# EAGLE design penghitopoco (EAGLE 7.6.0)
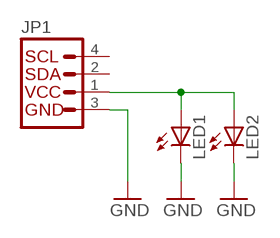
[diagram p0: schematic, sheet 1]

## Parts
JP1  I2C_STANDARDI2C_SAO  [2X2]
LED1  LED5MM  [LED5MM]
LED2  LED5MM  [LED5MM]

## Nets
GND: JP1.3(GND) LED1.K(C) LED2.K(C)
N$1: JP1.1(VCC) LED1.A LED2.A
Unconnected: JP1.2(SDA) JP1.4(SCL)

## Library data of the parts
JP1 = SparkFun-Connectors:I2C_STANDARD: SparkFun has standardized on a pinout for all I2C based sensor breakouts. This pinout allows I2C boards to be plugged directly into the headers on Arduino Uno compatible boards, and to be daisy chained easily.
LED1 LED2 = led:LED: LED OSRAM: - CHIPLED LG R971, LG N971, LY N971, LG Q971, LY Q971, LO R971, LY R971 LH N974, LH R974 LS Q976, LO Q976, LY Q976 LO Q996 - Hyper CHIPLED LW Q18S LB Q993, LB Q99A, LB R99A - SideLED LS A670, LO A670, LY A670, LG A670, LP A670 LB A673, LV A673, LT A673, LW A673 LH A674 LY A675 LS A676, LA A676, LO A676, LY A676, LW A676 LS A679, LY A679, LG A679 - Hyper Micro SIDELED® LS Y876, LA Y876, LO Y876, LY Y876 LT Y87S - SmartLED LW L88C, LW L88S LB L89C, LB L89S, LG L890 LS L89K, LO L89K, LY L89K LS L896, LA L896, LO L896, LY L896 - TOPLED LS T670, LO T670, LY T670, LG T670, LP T670 LSG T670, LSP T670, LSY T670, LOP T670, LYG T670 LG T671, LOG T671, LSG T671 LB T673, LV T673, LT T673, LW T673 LH T674 LS T676, LA T676, LO T676, LY T676, LB T676, LH T676, LSB T676, LW T676 LB T67C, LV T67C, LT T67C, LS T67K, LO T67K, LY T67K, LW E67C LS E67B, LA E67B, LO E67B, LY E67B, LB E67C, LV E67C, LT E67C LW T67C LS T679, LY T679, LG T679 LS T770, LO T770, LY T770, LG T770, LP T770 LB T773, LV T773, LT T773, LW T773 LH T774 LS E675, LA E675, LY E675, LS T675 LS T776, LA T776, LO T776, LY T776, LB T776 LHGB T686 LT T68C, LB T68C - Hyper Mini TOPLED® LB M676 - Mini TOPLED Santana® LG M470 LS M47K, LO M47K, LY M47K Source: http://www.osram.convergy.de LUXEON: - LUMILED® LXK2-PW12-R00, LXK2-PW12-S00, LXK2-PW14-U00, LXK2-PW14-V00 LXK2-PM12-R00, LXK2-PM12-S00, LXK2-PM14-U00 LXK2-PE12-Q00, LXK2-PE12-R00, LXK2-PE12-S00, LXK2-PE14-T00, LXK2-PE14-U00 LXK2-PB12-K00, LXK2-PB12-L00, LXK2-PB12-M00, LXK2-PB14-N00, LXK2-PB14-P00, LXK2-PB14-Q00 LXK2-PR12-L00, LXK2-PR12-M00, LXK2-PR14-Q00, LXK2-PR14-R00 LXK2-PD12-Q00, LXK2-PD12-R00, LXK2-PD12-S00 LXK2-PH12-R00, LXK2-PH12-S00 LXK2-PL12-P00, LXK2-PL12-Q00, LXK2-PL12-R00 Source: www.luxeon.com KINGBRIGHT: KA-3528ASYC Source: www.kingbright.com

## Board
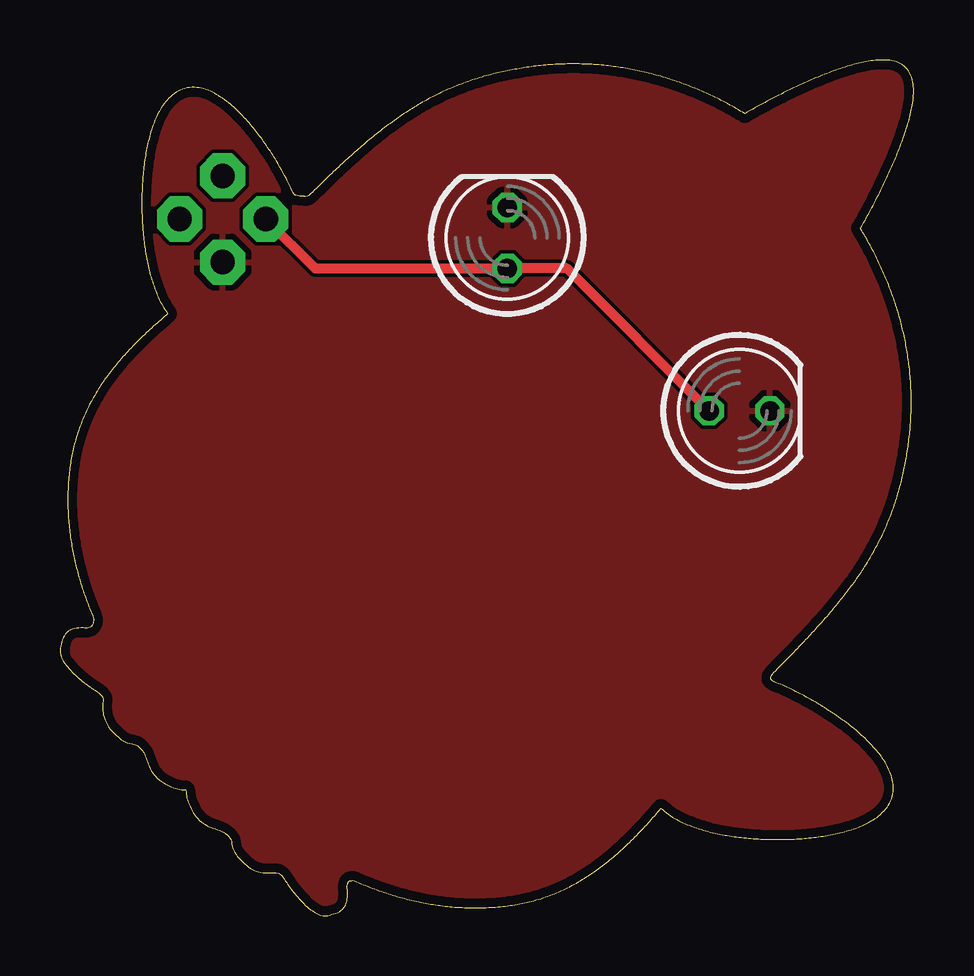
[diagram p1: board, top side]
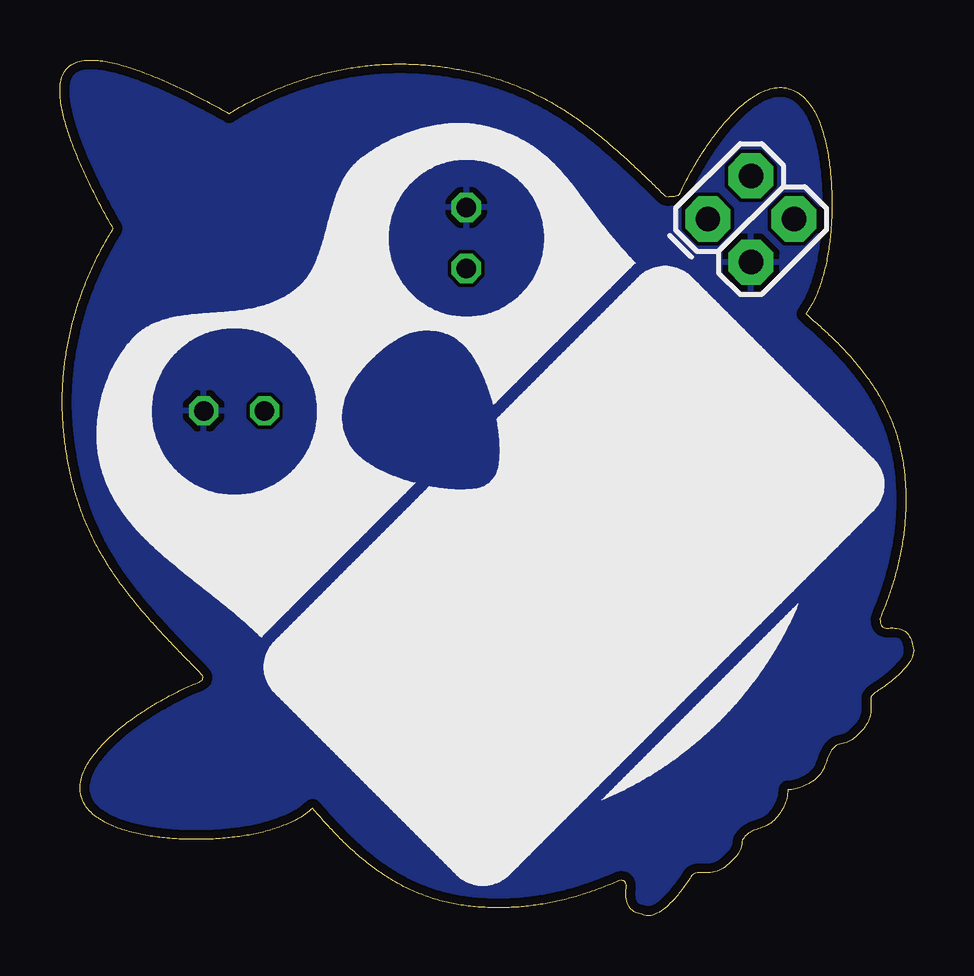
[diagram p2: board, bottom side, seen from below]

Size 35.59 x 35.66 mm. Coordinates in mm from the lower left corner, seen from the top.
Outline: 34.3,35.66 34.2,35.65 34.1,35.65 34,35.64 33.9,35.63 33.8,35.62 33.7,35.6 33.6,35.58 33.51,35.56 33.41,35.54 33.31,35.52 33.21,35.5 33.11,35.47 33.02,35.44 32.92,35.42 32.83,35.39 32.73,35.36 32.64,35.33 32.54,35.3 32.45,35.27 32.35,35.23 32.26,35.2 32.16,35.16 32.07,35.13 31.98,35.09 31.88,35.06 31.79,35.02 31.7,34.98 31.61,34.95 31.51,34.91 31.42,34.87 31.33,34.83 31.24,34.79 31.15,34.75 31.06,34.71 30.96,34.67 30.87,34.63 30.78,34.59 30.69,34.54 30.6,34.5 30.51,34.46 30.42,34.41 30.33,34.37 30.24,34.33 30.15,34.28 30.06,34.24 29.97,34.19 29.88,34.15 29.8,34.1 29.72,34.06 29.63,34.02 29.55,33.97 29.46,33.93 29.38,33.88 29.29,33.84 29.21,33.79 29.13,33.75 29.04,33.7 28.96,33.66 28.88,33.61 28.79,33.56 28.71,33.52 28.63,33.47 28.55,33.42 28.46,33.48 28.37,33.53 28.29,33.58 28.2,33.63 28.11,33.68 28.02,33.73 27.93,33.78 27.85,33.83 27.76,33.87 27.67,33.92 27.58,33.97 27.49,34.01 27.4,34.06 27.31,34.1 27.21,34.14 27.12,34.19 27.03,34.23 26.94,34.27 26.85,34.31 26.76,34.35 26.66,34.39 26.57,34.43 26.48,34.47 26.38,34.51 26.29,34.55 26.19,34.58 26.1,34.62 26.01,34.65 25.91,34.69 25.82,34.72 25.72,34.76 25.62,34.79 25.53,34.82 25.43,34.85 25.34,34.88 25.24,34.91 25.14,34.94 25.05,34.97 24.95,35 24.85,35.02 24.75,35.05 24.66,35.08 24.56,35.1 24.46,35.13 24.36,35.15 24.26,35.17 24.17,35.19 24.07,35.21 23.97,35.23 23.87,35.25 23.77,35.27 23.67,35.29 23.57,35.31 23.47,35.33 23.37,35.34 23.27,35.36 23.17,35.37 23.07,35.38 22.97,35.4 22.87,35.41 22.77,35.42 22.67,35.43 22.57,35.44 22.47,35.45 22.37,35.46 22.27,35.46 22.17,35.47 22.07,35.48 21.97,35.48 21.86,35.49 21.76,35.49 21.66,35.49 21.56,35.49 21.46,35.49 21.36,35.49 21.26,35.49 21.16,35.49 21.06,35.49 20.96,35.49 20.85,35.48 20.75,35.48 20.65,35.47 20.55,35.47 20.45,35.46 20.35,35.45 20.25,35.44 20.15,35.43 20.05,35.42 19.95,35.41 19.85,35.4 19.75,35.39 19.65,35.37 19.55,35.36 19.45,35.35 19.35,35.33 19.25,35.31 19.15,35.3 19.05,35.28 18.96,35.26 18.86,35.25 18.76,35.23 18.66,35.21 18.56,35.19 18.46,35.17 18.37,35.14 18.27,35.12 18.17,35.1 18.07,35.07 17.98,35.05 17.88,35.02 17.78,35 17.69,34.97 17.59,34.94 17.49,34.91 17.4,34.89 17.3,34.85 17.21,34.82 17.11,34.79 17.02,34.76 16.92,34.73 16.83,34.69 16.73,34.66 16.64,34.62 16.55,34.58 16.45,34.55 16.36,34.51 16.27,34.47 16.18,34.43 16.08,34.39 15.99,34.35 15.9,34.3 15.81,34.26 15.72,34.22 15.63,34.17 15.54,34.13 15.45,34.08 15.36,34.03 15.28,33.98 15.19,33.94 15.1,33.89 15.01,33.84 14.93,33.79 14.84,33.73 14.75,33.68 14.67,33.63 14.58,33.58 14.5,33.52 14.42,33.47 14.33,33.41 14.25,33.36 14.17,33.3 14.08,33.24 14,33.19 13.92,33.13 13.84,33.07 13.76,33.01 13.68,32.95 13.6,32.89 13.52,32.83 13.44,32.77 13.36,32.71 13.28,32.64 13.2,32.58 13.12,32.52 13.04,32.46 12.97,32.39 12.89,32.33 12.81,32.26 12.73,32.2 12.66,32.13 12.58,32.07 12.51,32 12.43,31.94 12.35,31.87 12.28,31.81 12.2,31.74 12.13,31.67 12.05,31.6 11.98,31.54 11.91,31.47 11.83,31.4 11.76,31.33 11.69,31.27 11.61,31.2 11.54,31.13 11.47,31.06 11.39,30.99 11.32,30.92 11.25,30.85 11.17,30.78 11.1,30.71 11.03,30.64 10.96,30.57 10.89,30.5 10.81,30.43 10.74,30.36 10.67,30.29 10.6,30.22 10.53,30.15 10.46,30.08 10.41,30.04 10.39,30.02 10.37,30 10.32,29.98 10.23,29.96 10.19,29.98 9.98,29.99 9.92,30 9.91,30.01 9.84,30.01 9.8,30.02 9.76,30.06 9.72,30.13 9.68,30.22 9.64,30.31 9.6,30.39 9.55,30.48 9.51,30.57 9.46,30.66 9.42,30.74 9.37,30.83 9.33,30.92 9.28,31 9.23,31.09 9.18,31.17 9.13,31.26 9.08,31.34 9.03,31.43 8.98,31.51 8.93,31.6 8.88,31.68 8.83,31.76 8.77,31.84 8.72,31.93 8.66,32.01 8.61,32.09 8.55,32.17 8.5,32.25 8.44,32.33 8.38,32.41 8.32,32.49 8.26,32.57 8.2,32.65 8.14,32.73 8.08,32.8 8.02,32.88 7.95,32.96 7.89,33.04 7.82,33.11 7.75,33.19 7.69,33.26 7.62,33.33 7.55,33.41 7.48,33.48 7.41,33.55 7.33,33.62 7.26,33.68 7.18,33.75 7.11,33.81 7.03,33.88 6.95,33.94 6.87,34 6.79,34.06 6.71,34.11 6.62,34.17 6.54,34.22 6.45,34.27 6.36,34.31 6.27,34.35 6.18,34.39 6.09,34.42 5.99,34.45 5.9,34.48 5.8,34.49 5.7,34.51 5.6,34.51 5.5,34.51 5.4,34.51 5.3,34.49 5.21,34.47 5.11,34.44 5.02,34.4 4.93,34.36 4.84,34.31 4.76,34.26 4.68,34.2 4.6,34.13 4.53,34.06 4.47,33.99 4.4,33.91 4.34,33.83 4.28,33.75 4.23,33.67 4.18,33.59 4.13,33.5 4.08,33.41 4.04,33.32 4,33.23 3.96,33.14 3.92,33.05 3.88,32.95 3.85,32.86 3.82,32.76 3.79,32.67 3.76,32.57 3.73,32.47 3.71,32.38 3.68,32.28 3.66,32.18 3.64,32.08 3.62,31.99 3.6,31.89 3.58,31.79 3.57,31.69 3.55,31.59 3.53,31.49 3.52,31.39 3.51,31.29 3.49,31.19 3.48,31.09 3.47,30.99 3.46,30.89 3.45,30.79 3.45,30.69 3.44,30.59 3.43,30.49 3.43,30.39 3.42,30.29 3.42,30.19 3.41,30.09 3.41,29.99 3.41,29.89 3.41,29.79 3.41,29.68 3.41,29.58 3.41,29.48 3.41,29.38 3.41,29.28 3.42,29.18 3.42,29.08 3.43,28.98 3.43,28.88 3.44,28.78 3.44,28.68 3.45,28.58 3.46,28.48 3.47,28.38 3.48,28.28 3.49,28.18 3.5,28.08 3.52,27.98 3.53,27.88 3.54,27.78 3.56,27.68 3.57,27.58 3.59,27.48 3.61,27.38 3.63,27.28 3.65,27.18 3.67,27.08 3.69,26.99 3.72,26.89 3.74,26.79 3.77,26.7 3.8,26.6 3.82,26.51 3.85,26.41 3.89,26.32 3.92,26.22 3.95,26.13 3.99,26.04 4.02,25.94 4.06,25.85 4.1,25.76 4.14,25.67 4.19,25.58 4.23,25.5 4.28,25.41 4.33,25.32 4.38,25.24 4.44,25.16 4.5,25.08 4.42,25.01 4.34,24.95 4.27,24.88 4.19,24.82 4.12,24.75 4.04,24.69 3.97,24.62 3.89,24.55 3.82,24.49 3.75,24.42 3.67,24.35 3.6,24.28 3.53,24.21 3.45,24.15 3.38,24.08 3.31,24.01 3.24,23.94 3.17,23.87 3.1,23.79 3.03,23.72 2.96,23.65 2.89,23.58 2.82,23.51 2.75,23.43 2.69,23.36 2.62,23.28 2.56,23.21 2.49,23.13 2.43,23.06 2.36,22.98 2.3,22.9 2.24,22.82 2.17,22.75 2.11,22.67 2.05,22.59 1.99,22.51 1.93,22.43 1.87,22.35 1.82,22.26 1.76,22.18 1.71,22.1 1.65,22.01 1.6,21.93 1.54,21.85 1.49,21.76 1.44,21.67 1.39,21.59 1.34,21.5 1.29,21.41 1.25,21.32 1.2,21.24 1.16,21.15 1.11,21.06 1.07,20.97 1.03,20.88 0.99,20.78 0.95,20.69 0.91,20.6 0.88,20.51 0.84,20.41 0.81,20.32 0.77,20.22 0.74,20.13 0.71,20.04 0.68,19.94 0.65,19.84 0.63,19.75 0.6,19.65 0.57,19.55 0.55,19.46 0.53,19.36 0.51,19.26 0.49,19.16 0.47,19.07 0.45,18.97 0.44,18.87 0.42,18.77 0.41,18.67 0.4,18.57 0.39,18.47 0.38,18.37 0.37,18.27 0.36,18.17 0.35,18.07 0.35,17.97 0.34,17.87 0.34,17.77 0.33,17.67 0.33,17.57 0.33,17.47 0.33,17.37 0.33,17.27 0.33,17.17 0.33,17.07 0.33,16.97 0.34,16.87 0.34,16.77 0.35,16.67 0.35,16.57 0.36,16.47 0.37,16.37 0.38,16.27 0.39,16.17 0.4,16.07 0.41,15.97 0.42,15.88 0.43,15.78 0.45,15.68 0.46,15.58 0.48,15.48 0.5,15.38 0.51,15.28 0.53,15.18 0.55,15.09 0.57,14.99 0.59,14.89 0.61,14.79 0.64,14.69 0.66,14.6 0.68,14.5 0.71,14.4 0.73,14.31 0.76,14.21 0.79,14.11 0.82,14.02 0.84,13.92 0.87,13.82 0.9,13.73 0.93,13.63 0.97,13.54 1,13.44 1.03,13.35 1.06,13.26 1.1,13.16 1.13,13.07 1.17,12.97 1.21,12.88 1.24,12.79 1.28,12.69 1.32,12.6 1.36,12.51 1.4,12.42 1.41,12.35 1.4,12.28 1.39,12.24 1.38,12.18 1.35,12.11 1.31,12.04 1.27,12.01 1.21,11.99 1.14,11.97 1.13,11.98 1.04,11.99 0.97,11.99 0.88,11.99 0.79,11.99 0.69,11.98 0.6,11.96 0.51,11.94 0.43,11.9 0.35,11.85 0.28,11.79 0.22,11.72 0.17,11.65 0.13,11.57 0.1,11.49 0.08,11.41 0.05,11.32 0.03,11.24 0.01,11.15 0,11.05 0.01,10.96 0.03,10.87 0.06,10.78 0.1,10.69 0.15,10.61 0.2,10.53 0.26,10.45 0.32,10.37 0.38,10.29 0.45,10.22 0.51,10.15 0.58,10.09 0.65,10.02 0.72,9.96 0.79,9.9 0.86,9.84 0.93,9.78 1.01,9.72 1.08,9.66 1.16,9.6 1.23,9.55 1.31,9.49 1.39,9.44 1.47,9.39 1.55,9.34 1.62,9.29 1.68,9.24 1.74,9.18 1.78,9.1 1.8,9.02 1.8,8.93 1.79,8.85 1.78,8.75 1.78,8.66 1.79,8.56 1.8,8.47 1.81,8.37 1.83,8.28 1.86,8.19 1.9,8.1 1.94,8.02 1.99,7.93 2.04,7.85 2.1,7.78 2.16,7.71 2.22,7.64 2.28,7.57 2.35,7.51 2.42,7.45 2.49,7.39 2.56,7.34 2.64,7.29 2.72,7.24 2.81,7.21 2.91,7.18 3,7.16 3.08,7.15 3.16,7.13 3.24,7.09 3.31,7.03 3.37,6.96 3.43,6.89 3.48,6.82 3.52,6.74 3.56,6.65 3.59,6.57 3.62,6.48 3.65,6.39 3.68,6.31 3.71,6.22 3.75,6.13 3.8,6.04 3.86,5.96 3.92,5.88 3.98,5.81 4.05,5.74 4.13,5.67 4.21,5.61 4.29,5.56 4.38,5.51 4.46,5.46 4.55,5.42 4.64,5.38 4.74,5.34 4.82,5.31 4.9,5.29 4.99,5.27 5.07,5.26 5.16,5.25 5.25,5.25 5.25,5.16 5.26,5.08 5.27,4.99 5.29,4.9 5.31,4.82 5.34,4.74 5.38,4.65 5.42,4.55 5.46,4.46 5.51,4.38 5.56,4.29 5.61,4.21 5.67,4.13 5.74,4.05 5.81,3.98 5.88,3.92 5.96,3.86 6.04,3.8 6.13,3.75 6.22,3.71 6.31,3.68 6.39,3.65 6.48,3.62 6.57,3.59 6.65,3.56 6.74,3.52 6.82,3.48 6.89,3.43 6.96,3.37 7.03,3.31 7.09,3.24 7.13,3.16 7.15,3.08 7.16,3 7.18,2.91 7.21,2.81 7.24,2.72 7.29,2.64 7.34,2.56 7.39,2.49 7.45,2.42 7.51,2.35 7.57,2.28 7.64,2.22 7.71,2.16 7.78,2.1 7.85,2.04 7.93,1.99 8.02,1.94 8.1,1.9 8.19,1.86 8.28,1.83 8.37,1.81 8.47,1.8 8.56,1.79 8.66,1.78 8.75,1.78 8.85,1.79 8.93,1.8 9.02,1.8 9.1,1.78 9.18,1.74 9.24,1.68 9.29,1.62 9.34,1.55 9.39,1.47 9.44,1.39 9.49,1.31 9.55,1.23 9.6,1.16 9.66,1.08 9.72,1.01 9.78,0.93 9.84,0.86 9.9,0.79 9.96,0.72 10.02,0.65 10.09,0.58 10.15,0.51 10.22,0.45 10.29,0.38 10.37,0.32 10.45,0.26 10.53,0.2 10.61,0.15 10.69,0.1 10.78,0.06 10.87,0.03 10.96,0.01 11.05,0 11.15,0.01 11.24,0.03 11.32,0.05 11.41,0.08 11.49,0.1 11.57,0.13 11.65,0.17 11.72,0.22 11.79,0.28 11.85,0.35 11.9,0.43 11.94,0.52 11.96,0.6 11.98,0.69 11.99,0.79 11.99,0.88 11.99,0.97 11.99,1.06 11.98,1.16 11.97,1.25 11.98,1.29 11.99,1.34 12.01,1.35 12.02,1.4 12.08,1.45 12.15,1.46 12.19,1.47 12.28,1.46 12.37,1.42 12.47,1.38 12.56,1.34 12.65,1.3 12.75,1.26 12.84,1.22 12.93,1.19 13.03,1.15 13.12,1.12 13.22,1.08 13.31,1.05 13.41,1.01 13.5,0.98 13.6,0.95 13.69,0.92 13.79,0.89 13.89,0.86 13.98,0.83 14.08,0.8 14.18,0.77 14.27,0.75 14.37,0.72 14.47,0.7 14.57,0.67 14.66,0.65 14.76,0.62 14.86,0.6 14.96,0.58 15.06,0.56 15.16,0.54 15.26,0.52 15.35,0.5 15.45,0.49 15.55,0.47 15.65,0.46 15.75,0.44 15.85,0.43 15.95,0.42 16.05,0.4 16.15,0.39 16.25,0.38 16.35,0.37 16.45,0.36 16.55,0.36 16.66,0.35 16.76,0.34 16.86,0.34 16.96,0.34 17.06,0.33 17.16,0.33 17.26,0.33 17.36,0.33 17.46,0.33 17.56,0.33 17.66,0.34 17.76,0.34 17.86,0.34 17.97,0.35 18.07,0.36 18.17,0.36 18.27,0.37 18.37,0.38 18.47,0.39 18.57,0.4 18.67,0.42 18.77,0.43 18.87,0.44 18.97,0.46 19.07,0.48 19.17,0.5 19.26,0.51 19.36,0.54 19.46,0.56 19.56,0.58 19.66,0.61 19.75,0.63 19.85,0.66 19.95,0.69 20.04,0.72 20.14,0.75 20.24,0.78 20.33,0.82 20.43,0.85 20.52,0.89 20.61,0.92 20.71,0.96 20.8,1 20.89,1.04 20.98,1.09 21.08,1.13 21.17,1.17 21.26,1.22 21.35,1.26 21.43,1.31 21.52,1.36 21.61,1.41 21.7,1.46 21.78,1.51 21.87,1.57 21.96,1.62 22.04,1.67 22.12,1.73 22.21,1.79 22.29,1.84 22.37,1.9 22.46,1.96 22.54,2.02 22.62,2.08 22.7,2.14 22.78,2.21 22.86,2.27 22.93,2.33 23.01,2.4 23.09,2.46 23.17,2.53 23.24,2.59 23.32,2.66 23.39,2.73 23.47,2.79 23.54,2.86 23.61,2.93 23.69,3 23.76,3.07 23.83,3.14 23.9,3.21 23.97,3.29 24.04,3.36 24.11,3.43 24.18,3.5 24.25,3.58 24.32,3.65 24.39,3.72 24.46,3.8 24.53,3.87 24.59,3.95 24.66,4.02 24.73,4.1 24.79,4.18 24.86,4.25 24.93,4.33 24.99,4.4 25.06,4.48 25.13,4.41 25.21,4.35 25.29,4.28 25.37,4.23 25.45,4.17 25.53,4.11 25.62,4.06 25.71,4.01 25.8,3.97 25.89,3.92 25.98,3.88 26.07,3.84 26.16,3.8 26.26,3.76 26.35,3.73 26.44,3.69 26.54,3.66 26.63,3.63 26.73,3.6 26.83,3.57 26.92,3.54 27.02,3.51 27.12,3.49 27.22,3.47 27.31,3.44 27.41,3.42 27.51,3.4 27.61,3.38 27.71,3.36 27.81,3.35 27.91,3.33 28.01,3.31 28.11,3.3 28.21,3.29 28.31,3.27 28.41,3.26 28.51,3.25 28.61,3.24 28.71,3.23 28.81,3.22 28.91,3.22 29.01,3.21 29.11,3.2 29.21,3.2 29.31,3.19 29.41,3.19 29.51,3.19 29.61,3.18 29.71,3.18 29.81,3.18 30.02,3.18 30.12,3.18 30.22,3.18 30.32,3.19 30.42,3.19 30.52,3.19 30.62,3.2 30.72,3.2 30.82,3.21 30.92,3.22 31.02,3.23 31.12,3.23 31.22,3.24 31.32,3.25 31.42,3.27 31.52,3.28 31.62,3.29 31.72,3.31 31.82,3.32 31.92,3.34 32.02,3.35 32.12,3.37 32.21,3.39 32.31,3.41 32.41,3.43 32.51,3.46 32.61,3.48 32.7,3.51 32.8,3.53 32.9,3.56 32.99,3.59 33.09,3.62 33.18,3.66 33.27,3.69 33.37,3.73 33.46,3.77 33.55,3.81 33.64,3.85 33.73,3.9 33.81,3.95 33.9,4 33.98,4.05 34.06,4.11 34.14,4.17 34.22,4.24 34.29,4.3 34.36,4.38 34.43,4.45 34.49,4.53 34.54,4.61 34.59,4.7 34.63,4.79 34.67,4.88 34.7,4.98 34.72,5.07 34.74,5.17 34.74,5.27 34.74,5.37 34.74,5.47 34.72,5.57 34.71,5.67 34.68,5.76 34.65,5.86 34.62,5.95 34.58,6.04 34.54,6.13 34.49,6.22 34.45,6.31 34.4,6.39 34.34,6.48 34.29,6.56 34.23,6.64 34.17,6.72 34.11,6.8 34.04,6.88 33.98,6.96 33.91,7.03 33.84,7.1 33.78,7.18 33.71,7.25 33.63,7.32 33.56,7.39 33.49,7.46 33.42,7.52 33.34,7.59 33.26,7.66 33.19,7.72 33.11,7.79 33.03,7.85 32.95,7.91 32.88,7.97 32.8,8.04 32.72,8.1 32.64,8.16 32.56,8.21 32.47,8.27 32.39,8.33 32.31,8.39 32.23,8.44 32.14,8.5 32.06,8.55 31.98,8.61 31.89,8.66 31.81,8.71 31.72,8.77 31.64,8.82 31.55,8.87 31.46,8.92 31.38,8.97 31.29,9.02 31.2,9.07 31.12,9.11 31.03,9.16 30.94,9.21 30.85,9.25 30.76,9.3 30.67,9.34 30.58,9.39 30.49,9.43 30.4,9.47 30.31,9.52 30.22,9.56 30.13,9.6 30.04,9.64 29.95,9.68 29.85,9.71 29.76,9.75 29.69,9.79 29.65,9.82 29.63,9.86 29.63,9.96 29.65,10 29.69,10.07 29.76,10.14 29.84,10.22 29.91,10.29 29.98,10.36 30.05,10.43 30.12,10.5 30.19,10.57 30.26,10.65 30.33,10.72 30.4,10.79 30.47,10.86 30.54,10.93 30.61,11.01 30.68,11.08 30.75,11.15 30.82,11.22 30.89,11.3 30.96,11.37 31.03,11.44 31.1,11.52 31.17,11.59 31.24,11.66 31.31,11.74 31.37,11.81 31.44,11.88 31.51,11.96 31.58,12.03 31.65,12.11 31.71,12.18 31.78,12.26 31.85,12.33 31.91,12.41 31.98,12.49 32.05,12.56 32.11,12.64 32.18,12.71 32.24,12.79 32.31,12.87 32.37,12.95 32.43,13.02 32.5,13.1 32.56,13.18 32.62,13.26 32.69,13.34 32.75,13.42 32.81,13.5 32.87,13.58 32.93,13.66 32.99,13.74 33.05,13.82 33.11,13.9 33.17,13.99 33.23,14.07 33.28,14.15 33.34,14.23 33.4,14.32 33.45,14.4 33.51,14.49 33.56,14.57 33.62,14.66 33.67,14.74 33.72,14.83 33.77,14.91 33.82,15 33.87,15.09 33.92,15.18 33.97,15.26 34.02,15.35 34.07,15.44 34.11,15.53 34.16,15.62 34.21,15.71 34.25,15.8 34.29,15.89 34.34,15.98 34.38,16.07 34.42,16.17 34.46,16.26 34.5,16.35 34.54,16.44 34.58,16.54 34.61,16.63 34.65,16.73 34.68,16.82 34.72,16.91 34.75,17.01 34.78,17.1 34.82,17.2 34.85,17.3 34.88,17.39 34.91,17.49 34.94,17.58 34.97,17.68 34.99,17.78 35.02,17.88 35.04,17.97 35.07,18.07 35.09,18.17 35.12,18.27 35.14,18.36 35.16,18.46 35.18,18.56 35.2,18.66 35.22,18.76 35.24,18.86 35.26,18.96 35.28,19.06 35.29,19.16 35.31,19.25 35.33,19.35 35.34,19.45 35.36,19.55 35.37,19.65 35.38,19.75 35.39,19.85 35.41,19.95 35.42,20.05 35.43,20.15 35.44,20.25 35.45,20.36 35.45,20.46 35.46,20.56 35.47,20.66 35.47,20.76 35.48,20.86 35.48,20.96 35.49,21.06 35.49,21.16 35.49,21.26 35.49,21.36 35.49,21.46 35.49,21.57 35.49,21.67 35.49,21.77 35.48,21.87 35.48,21.97 35.47,22.07 35.47,22.17 35.46,22.27 35.45,22.37 35.45,22.47 35.44,22.57 35.43,22.67 35.42,22.77 35.41,22.88 35.39,22.98 35.38,23.08 35.37,23.18 35.35,23.28 35.34,23.38 35.32,23.47 35.31,23.57 35.29,23.67 35.27,23.77 35.25,23.87 35.23,23.97 35.21,24.07 35.19,24.17 35.17,24.27 35.15,24.37 35.12,24.46 35.1,24.56 35.07,24.66 35.05,24.76 35.02,24.86 34.99,24.95 34.97,25.05 34.94,25.15 34.91,25.24 34.88,25.34 34.85,25.44 34.82,25.53 34.79,25.63 34.75,25.72 34.72,25.82 34.69,25.91 34.65,26.01 34.62,26.1 34.58,26.2 34.54,26.29 34.51,26.39 34.47,26.48 34.43,26.57 34.39,26.67 34.35,26.76 34.31,26.85 34.27,26.94 34.23,27.04 34.18,27.13 34.14,27.22 34.1,27.31 34.05,27.4 34.01,27.49 33.96,27.58 33.92,27.67 33.87,27.76 33.82,27.85 33.77,27.94 33.73,28.03 33.68,28.11 33.63,28.2 33.58,28.29 33.52,28.38 33.47,28.46 33.42,28.55 33.37,28.64 33.42,28.72 33.47,28.81 33.52,28.9 33.56,28.98 33.61,29.07 33.66,29.16 33.71,29.25 33.76,29.33 33.8,29.42 33.85,29.51 33.9,29.6 33.94,29.69 33.99,29.78 34.03,29.86 34.08,29.95 34.13,30.04 34.17,30.13 34.21,30.22 34.26,30.31 34.3,30.4 34.35,30.49 34.39,30.58 34.43,30.67 34.47,30.76 34.52,30.85 34.56,30.94 34.6,31.03 34.64,31.12 34.68,31.22 34.72,31.31 34.76,31.4 34.8,31.49 34.84,31.58 34.88,31.67 34.92,31.77 34.95,31.86 34.99,31.95 35.03,32.05 35.06,32.14 35.1,32.23 35.13,32.33 35.16,32.42 35.2,32.51 35.23,32.61 35.26,32.7 35.29,32.8 35.32,32.89 35.35,32.99 35.38,33.09 35.4,33.18 35.43,33.28 35.45,33.38 35.47,33.48 35.5,33.57 35.52,33.67 35.53,33.77 35.55,33.87 35.56,33.97 35.57,34.07 35.58,34.17 35.59,34.27 35.59,34.37 35.59,34.47 35.58,34.56 35.57,34.65 35.56,34.75 35.54,34.84 35.51,34.93 35.48,35.02 35.43,35.11 35.39,35.19 35.33,35.26 35.27,35.34 35.2,35.4 35.12,35.46 35.04,35.5 34.95,35.54 34.86,35.58 34.77,35.6 34.68,35.62 34.59,35.64 34.49,35.65 34.4,35.65 34.3,35.66
Copper layers (1*16): Top 0.0356mm / dielectric 1.5011mm / Bottom 0.0356mm
Design rules "LaenPCBOrder": minimum track width 6mil, minimum drill 13mil, track to track 6mil, track to pad 6mil, pad to pad 6mil, via to via 6mil, smd to smd 6mil, copper to edge 15mil, drill to drill 6mil, minimum pad ring 7mil, minimum via ring 7mil, stop-mask expansion 3mil, vias tented up to drill 0mil, thermal gap 10mil

### Footprints (pad centres in the part's own frame; a part is rotated, then mirrored left to right if it is on the bottom)
2X2 = drill 1.016 pad 1.88 octagon: 1 0,0; 2 0,2.54; 3 2.54,0; 4 2.54,2.54
LED5MM = drill 0.813 octagon: A -1.27,0; K 1.27,0

### Placement (x,y rotation side)
JP1  8.58,29.03 315 bottom
LED1  18.65,28.24 90 top
LED2  28.33,21.04 0 top

### Tracks (layer width: path | path; a pad name or v marks a point on that pad's centre or on a via)
GND
  pour Bottom: -2.53,50.81 53.35,50.81 53.35,0.01 -2.53,0.01
  pour Top: 0.01,53.35 50.81,53.35 50.81,-2.53 0.01,-2.53
N$1
  Top 0.406: JP1.1 10.64,26.97 LED1.A 21.13,26.97 LED2.A